# Altium schematic sheet STM32_SWD_Connector.SchDoc
size Letter
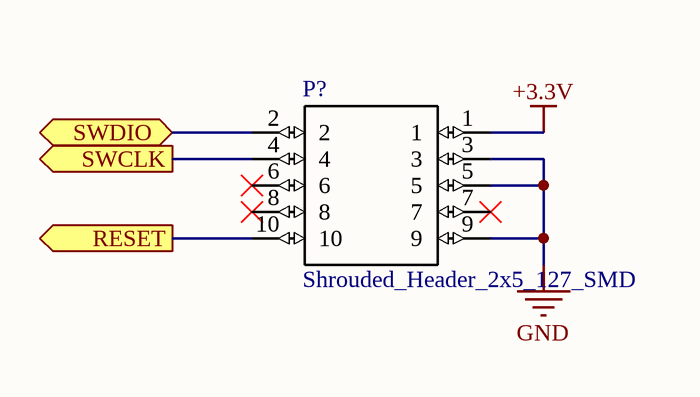
[diagram p0: STM32_SWD_Connector.SchDoc]

## Parts
P?  Shrouded_Header_2x5_127_SMD  [Shrouded_Header_2x5_127_SMD]

## Ports
RESET (out), SWCLK (out), SWDIO (bidir)

## Nets
+3.3V: P?.1
GND: P?.3 P?.5 P?.9
RESET: P?.10 ; port RESET
SWCLK: P?.4 ; port SWCLK
SWDIO: P?.2 ; port SWDIO

Not connected (* = marked no-connect by the designer): P? 6* 7* 8*